# Altium schematic sheet LPDDR4_SDRAM_2.SchDoc
size A3; SheetNumber: 15; SheetTotal: 20
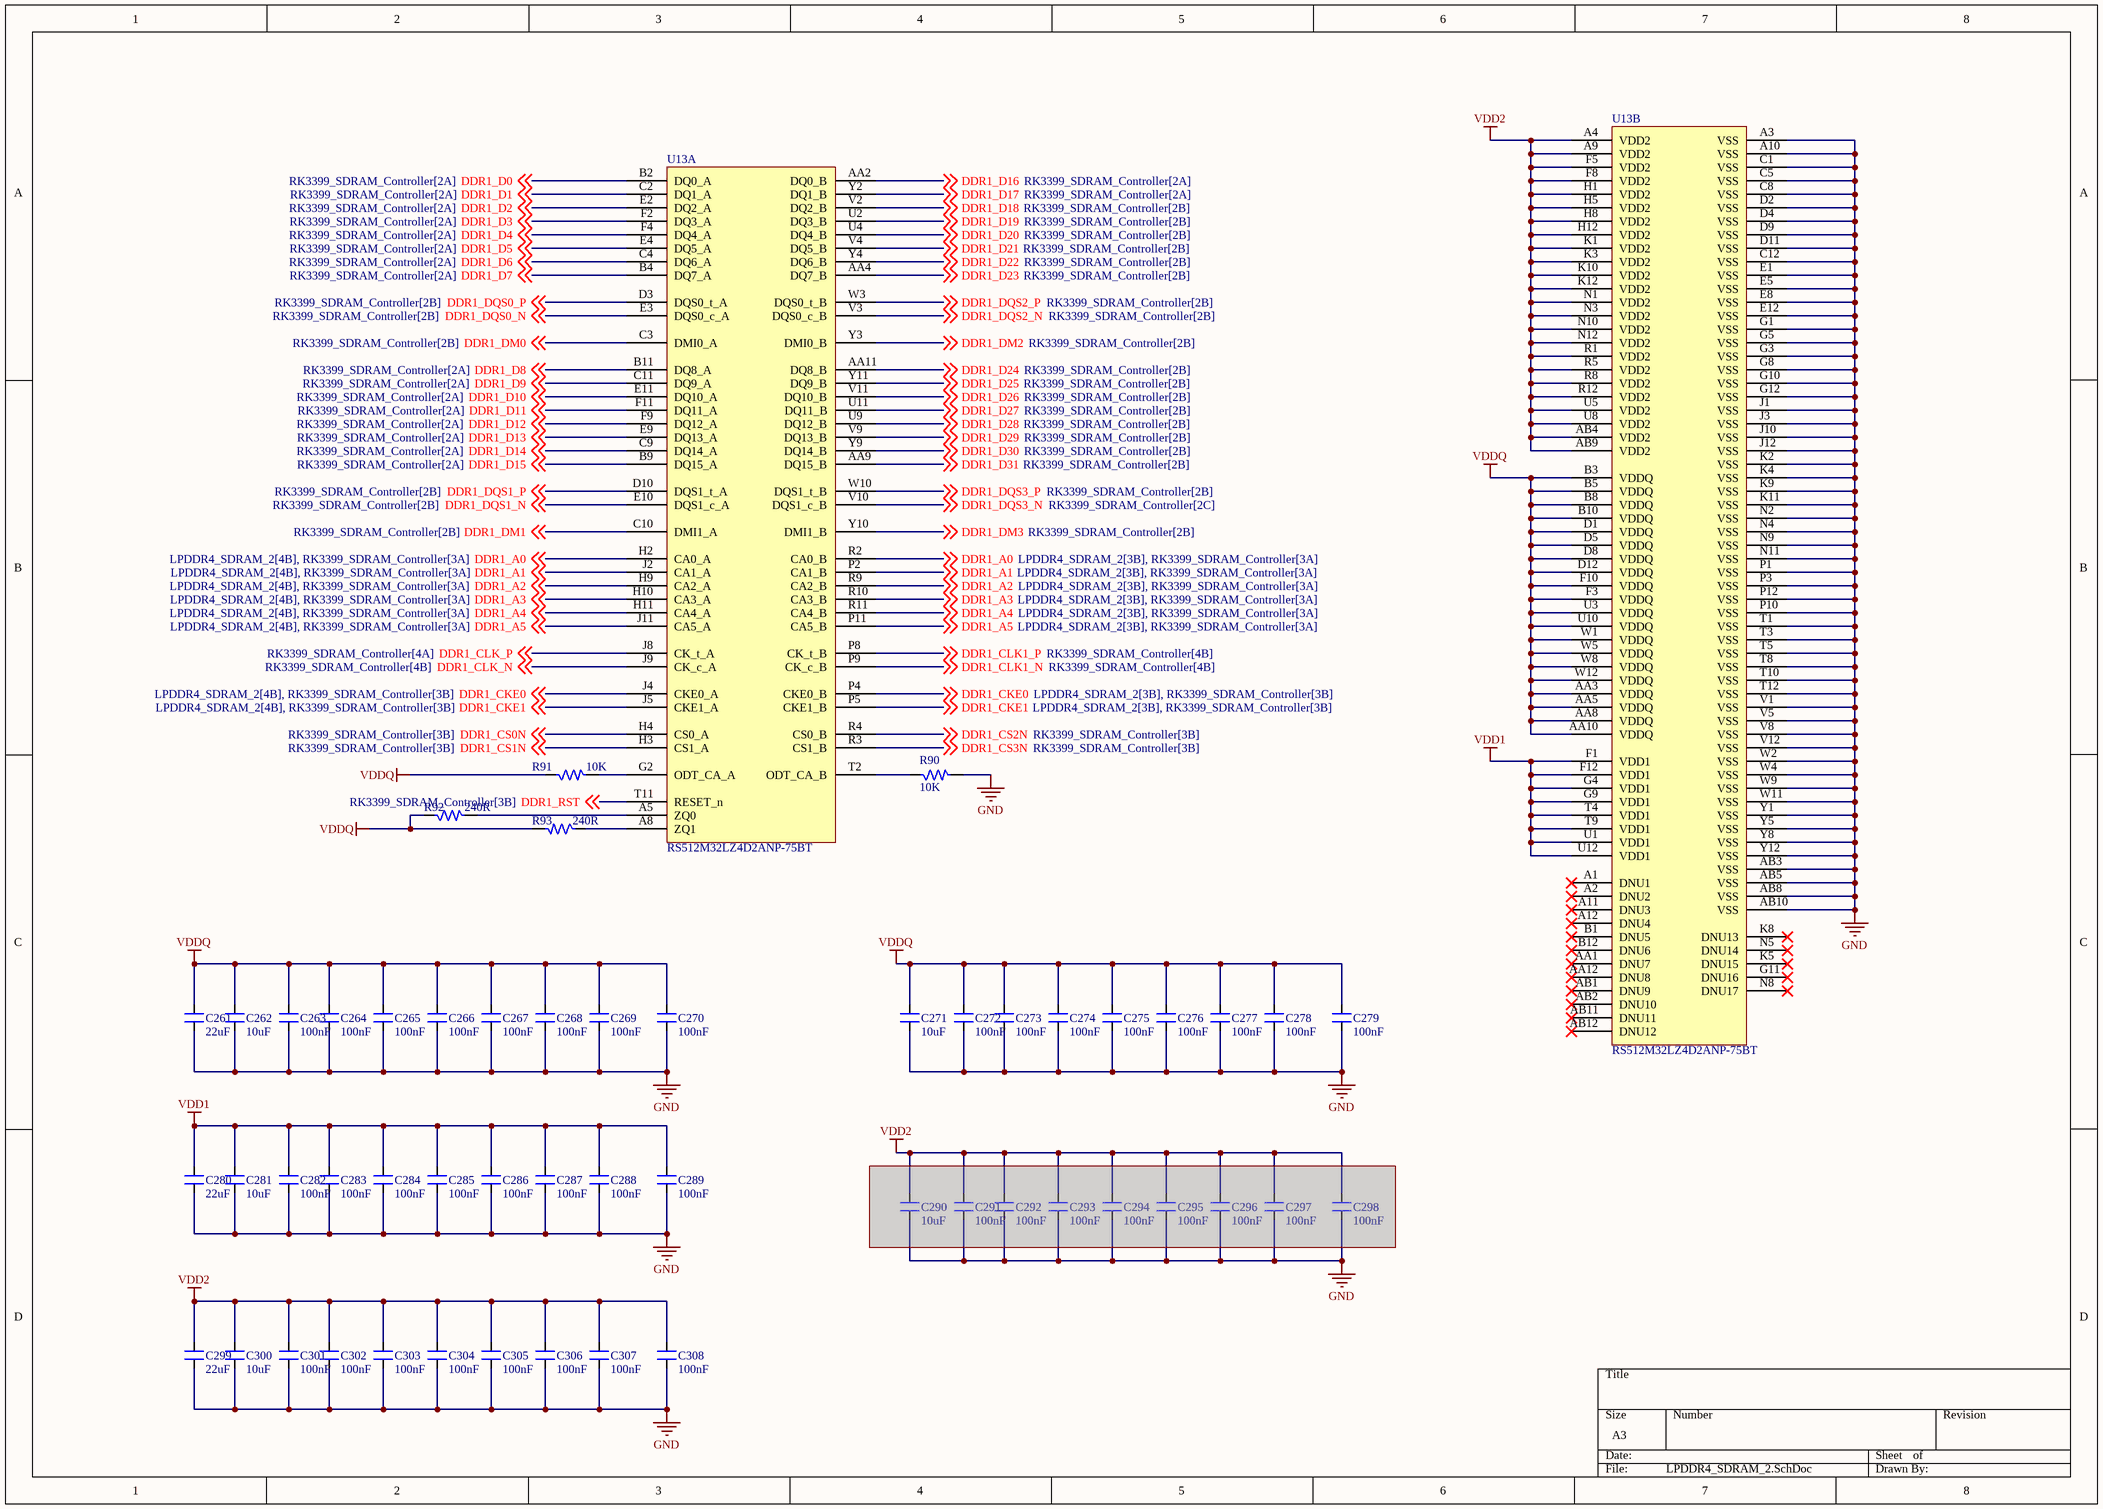
[diagram p0: LPDDR4_SDRAM_2.SchDoc]

## Parts
C261  22uF  [CAP_0603]
C262  10uF  [CAP_0603]
C263  100nF  [CAP_0201]
C264  100nF  [CAP_0201]
C265  100nF  [CAP_0201]
C266  100nF  [CAP_0201]
C267  100nF  [CAP_0201]
C268  100nF  [CAP_0201]
C269  100nF  [CAP_0201]
C270  100nF  [CAP_0201]
C271  10uF  [CAP_0603]
C272  100nF  [CAP_0201]
C273  100nF  [CAP_0201]
C274  100nF  [CAP_0201]
C275  100nF  [CAP_0201]
C276  100nF  [CAP_0201]
C277  100nF  [CAP_0201]
C278  100nF  [CAP_0201]
C279  100nF  [CAP_0201]
C280  22uF  [CAP_0603]
C281  10uF  [CAP_0603]
C282  100nF  [CAP_0201]
C283  100nF  [CAP_0201]
C284  100nF  [CAP_0201]
C285  100nF  [CAP_0201]
C286  100nF  [CAP_0201]
C287  100nF  [CAP_0201]
C288  100nF  [CAP_0201]
C289  100nF  [CAP_0201]
C290  10uF  [CAP_0603]  (masked out: inside a compile mask, not in the netlist)
C291  100nF  [CAP_0201]  (masked out: inside a compile mask, not in the netlist)
C292  100nF  [CAP_0201]  (masked out: inside a compile mask, not in the netlist)
C293  100nF  [CAP_0201]  (masked out: inside a compile mask, not in the netlist)
C294  100nF  [CAP_0201]  (masked out: inside a compile mask, not in the netlist)
C295  100nF  [CAP_0201]  (masked out: inside a compile mask, not in the netlist)
C296  100nF  [CAP_0201]  (masked out: inside a compile mask, not in the netlist)
C297  100nF  [CAP_0201]  (masked out: inside a compile mask, not in the netlist)
C298  100nF  [CAP_0201]  (masked out: inside a compile mask, not in the netlist)
C299  22uF  [CAP_0603]
C300  10uF  [CAP_0603]
C301  100nF  [CAP_0201]
C302  100nF  [CAP_0201]
C303  100nF  [CAP_0201]
C304  100nF  [CAP_0201]
C305  100nF  [CAP_0201]
C306  100nF  [CAP_0201]
C307  100nF  [CAP_0201]
C308  100nF  [CAP_0201]
R90  10K  [RES_0201]
R91  10K  [RES_0201]
R92  240R  [RES_0201]
R93  240R  [RES_0201]
U13  RS512M32LZ4D2ANP-75BT  [FBGA200_SMD]  (parts A,B of 2)

## Nets
GND: C261.1 C262.1 C263.2 C264.2 C265.2 C266.2 C267.2 C268.2 C269.2 C270.2 C271.1 C272.2 C273.2 C274.2 C275.2 C276.2 C277.2 C278.2 C279.2 C280.1 C281.1 C282.2 C283.2 C284.2 C285.2 C286.2 C287.2 C288.2 C289.2 C299.1 C300.1 C301.2 C302.2 C303.2 C304.2 C305.2 C306.2 C307.2 C308.2 R90.2 U13.A3(VSS) U13.A10(VSS) U13.AB3(VSS) U13.AB5(VSS) U13.AB8(VSS) U13.AB10(VSS) U13.C1(VSS) U13.C5(VSS) U13.C8(VSS) U13.C12(VSS) U13.D2(VSS) U13.D4(VSS) U13.D9(VSS) U13.D11(VSS) U13.E1(VSS) U13.E5(VSS) U13.E8(VSS) U13.E12(VSS) U13.G1(VSS) U13.G3(VSS) U13.G5(VSS) U13.G8(VSS) U13.G10(VSS) U13.G12(VSS) U13.J1(VSS) U13.J3(VSS) U13.J10(VSS) U13.J12(VSS) U13.K2(VSS) U13.K4(VSS) U13.K9(VSS) U13.K11(VSS) U13.N2(VSS) U13.N4(VSS) U13.N9(VSS) U13.N11(VSS) U13.P1(VSS) U13.P3(VSS) U13.P10(VSS) U13.P12(VSS) U13.T1(VSS) U13.T3(VSS) U13.T5(VSS) U13.T8(VSS) U13.T10(VSS) U13.T12(VSS) U13.V1(VSS) U13.V5(VSS) U13.V8(VSS) U13.V12(VSS) U13.W2(VSS) U13.W4(VSS) U13.W9(VSS) U13.W11(VSS) U13.Y1(VSS) U13.Y5(VSS) U13.Y8(VSS) U13.Y12(VSS)
VDD1: C280.2 C281.2 C282.1 C283.1 C284.1 C285.1 C286.1 C287.1 C288.1 C289.1 U13.F1(VDD1) U13.F12(VDD1) U13.G4(VDD1) U13.G9(VDD1) U13.T4(VDD1) U13.T9(VDD1) U13.U1(VDD1) U13.U12(VDD1)
VDD2: C299.2 C300.2 C301.1 C302.1 C303.1 C304.1 C305.1 C306.1 C307.1 C308.1 U13.A4(VDD2) U13.A9(VDD2) U13.AB4(VDD2) U13.AB9(VDD2) U13.F5(VDD2) U13.F8(VDD2) U13.H1(VDD2) U13.H5(VDD2) U13.H8(VDD2) U13.H12(VDD2) U13.K1(VDD2) U13.K3(VDD2) U13.K10(VDD2) U13.K12(VDD2) U13.N1(VDD2) U13.N3(VDD2) U13.N10(VDD2) U13.N12(VDD2) U13.R1(VDD2) U13.R5(VDD2) U13.R8(VDD2) U13.R12(VDD2) U13.U5(VDD2) U13.U8(VDD2)
VDDQ: C261.2 C262.2 C263.1 C264.1 C265.1 C266.1 C267.1 C268.1 C269.1 C270.1 C271.2 C272.1 C273.1 C274.1 C275.1 C276.1 C277.1 C278.1 C279.1 R91.1 R92.1 R93.2 U13.AA3(VDDQ) U13.AA5(VDDQ) U13.AA8(VDDQ) U13.AA10(VDDQ) U13.B3(VDDQ) U13.B5(VDDQ) U13.B8(VDDQ) U13.B10(VDDQ) U13.D1(VDDQ) U13.D5(VDDQ) U13.D8(VDDQ) U13.D12(VDDQ) U13.F3(VDDQ) U13.F10(VDDQ) U13.U3(VDDQ) U13.U10(VDDQ) U13.W1(VDDQ) U13.W5(VDDQ) U13.W8(VDDQ) U13.W12(VDDQ)
DDR1_A0: U13.H2(CA0_A) U13.R2(CA0_B) ; off-sheet DDR1_A0
DDR1_A1: U13.J2(CA1_A) U13.P2(CA1_B) ; off-sheet DDR1_A1
DDR1_A2: U13.H9(CA2_A) U13.R9(CA2_B) ; off-sheet DDR1_A2
DDR1_A3: U13.H10(CA3_A) U13.R10(CA3_B) ; off-sheet DDR1_A3
DDR1_A4: U13.H11(CA4_A) U13.R11(CA4_B) ; off-sheet DDR1_A4
DDR1_A5: U13.J11(CA5_A) U13.P11(CA5_B) ; off-sheet DDR1_A5
DDR1_CKE0: U13.J4(CKE0_A) U13.P4(CKE0_B) ; off-sheet DDR1_CKE0
DDR1_CKE1: U13.J5(CKE1_A) U13.P5(CKE1_B) ; off-sheet DDR1_CKE1
DDR1_CLK1_N: U13.P9(CK_c_B) ; off-sheet DDR1_CLK1_N
DDR1_CLK1_P: U13.P8(CK_t_B) ; off-sheet DDR1_CLK1_P
DDR1_CLK_N: U13.J9(CK_c_A) ; off-sheet DDR1_CLK_N
DDR1_CLK_P: U13.J8(CK_t_A) ; off-sheet DDR1_CLK_P
DDR1_CS0N: U13.H4(CS0_A) ; off-sheet DDR1_CS0N
DDR1_CS1N: U13.H3(CS1_A) ; off-sheet DDR1_CS1N
DDR1_CS2N: U13.R4(CS0_B) ; off-sheet DDR1_CS2N
DDR1_CS3N: U13.R3(CS1_B) ; off-sheet DDR1_CS3N
DDR1_D0: U13.B2(DQ0_A) ; off-sheet DDR1_D0
DDR1_D1: U13.C2(DQ1_A) ; off-sheet DDR1_D1
DDR1_D2: U13.E2(DQ2_A) ; off-sheet DDR1_D2
DDR1_D3: U13.F2(DQ3_A) ; off-sheet DDR1_D3
DDR1_D4: U13.F4(DQ4_A) ; off-sheet DDR1_D4
DDR1_D5: U13.E4(DQ5_A) ; off-sheet DDR1_D5
DDR1_D6: U13.C4(DQ6_A) ; off-sheet DDR1_D6
DDR1_D7: U13.B4(DQ7_A) ; off-sheet DDR1_D7
DDR1_D8: U13.B11(DQ8_A) ; off-sheet DDR1_D8
DDR1_D9: U13.C11(DQ9_A) ; off-sheet DDR1_D9
DDR1_D10: U13.E11(DQ10_A) ; off-sheet DDR1_D10
DDR1_D11: U13.F11(DQ11_A) ; off-sheet DDR1_D11
DDR1_D12: U13.F9(DQ12_A) ; off-sheet DDR1_D12
DDR1_D13: U13.E9(DQ13_A) ; off-sheet DDR1_D13
DDR1_D14: U13.C9(DQ14_A) ; off-sheet DDR1_D14
DDR1_D15: U13.B9(DQ15_A) ; off-sheet DDR1_D15
DDR1_D16: U13.AA2(DQ0_B) ; off-sheet DDR1_D16
DDR1_D17: U13.Y2(DQ1_B) ; off-sheet DDR1_D17
DDR1_D18: U13.V2(DQ2_B) ; off-sheet DDR1_D18
DDR1_D19: U13.U2(DQ3_B) ; off-sheet DDR1_D19
DDR1_D20: U13.U4(DQ4_B) ; off-sheet DDR1_D20
DDR1_D21: U13.V4(DQ5_B) ; off-sheet DDR1_D21
DDR1_D22: U13.Y4(DQ6_B) ; off-sheet DDR1_D22
DDR1_D23: U13.AA4(DQ7_B) ; off-sheet DDR1_D23
DDR1_D24: U13.AA11(DQ8_B) ; off-sheet DDR1_D24
DDR1_D25: U13.Y11(DQ9_B) ; off-sheet DDR1_D25
DDR1_D26: U13.V11(DQ10_B) ; off-sheet DDR1_D26
DDR1_D27: U13.U11(DQ11_B) ; off-sheet DDR1_D27
DDR1_D28: U13.U9(DQ12_B) ; off-sheet DDR1_D28
DDR1_D29: U13.V9(DQ13_B) ; off-sheet DDR1_D29
DDR1_D30: U13.Y9(DQ14_B) ; off-sheet DDR1_D30
DDR1_D31: U13.AA9(DQ15_B) ; off-sheet DDR1_D31
DDR1_DM0: U13.C3(DMI0_A) ; off-sheet DDR1_DM0
DDR1_DM1: U13.C10(DMI1_A) ; off-sheet DDR1_DM1
DDR1_DM2: U13.Y3(DMI0_B) ; off-sheet DDR1_DM2
DDR1_DM3: U13.Y10(DMI1_B) ; off-sheet DDR1_DM3
DDR1_DQS0_N: U13.E3(DQS0_c_A) ; off-sheet DDR1_DQS0_N
DDR1_DQS0_P: U13.D3(DQS0_t_A) ; off-sheet DDR1_DQS0_P
DDR1_DQS1_N: U13.E10(DQS1_c_A) ; off-sheet DDR1_DQS1_N
DDR1_DQS1_P: U13.D10(DQS1_t_A) ; off-sheet DDR1_DQS1_P
DDR1_DQS2_N: U13.V3(DQS0_c_B) ; off-sheet DDR1_DQS2_N
DDR1_DQS2_P: U13.W3(DQS0_t_B) ; off-sheet DDR1_DQS2_P
DDR1_DQS3_N: U13.V10(DQS1_c_B) ; off-sheet DDR1_DQS3_N
DDR1_DQS3_P: U13.W10(DQS1_t_B) ; off-sheet DDR1_DQS3_P
DDR1_RST: U13.T11(RESET_n) ; off-sheet DDR1_RST
NetR90_1: R90.1 U13.T2(ODT_CA_B)
NetR91_2: R91.2 U13.G2(ODT_CA_A)
NetR92_2: R92.2 U13.A5(ZQ0)
NetR93_1: R93.1 U13.A8(ZQ1)

Not connected (* = marked no-connect by the designer): U13 A1(DNU1)* A2(DNU2)* A11(DNU3)* A12(DNU4)* AA1(DNU7)* AA12(DNU8)* AB1(DNU9)* AB2(DNU10)* AB11(DNU11)* AB12(DNU12)* B1(DNU5)* B12(DNU6)* G11(DNU16)* K5(DNU15)* K8(DNU13)* N5(DNU14)* N8(DNU17)*

## Library data of the parts
C261 C280 C299 = CAP_22uF-10V-20%-0603: 22µF ±20% 10V Ceramic Capacitor X5R 0603 (1608 Metric); Manufacturer: Murata Electronics; Manufacturer Part Number: GRM188R61A226ME15D; Case/Package: 0603; Supplier-1: Digikey
C262 C271 C281 C290 C300 = CAP_10uF-10V-10%-0603: 10µF ±10% 10V Ceramic Capacitor X5R 0603 (1608 Metric); Manufacturer Part Number: GRM188R61A106KE69J; Manufacturer: Murata Electronics; Case/Package: 0603; Supplier-1: Digikey
C263-C270 C272-C279 C282-C289 C291-C298 C301-C308 = CAP_100nF-25V-10%-0201: 0.1µF ±10% 25V Ceramic Capacitor X5R 0201 (0603 Metric); Manufacturer: TDK Corporation; Manufacturer Part Number: C0603X5R1E104K030BB; Case/Package: 0201; Supplier-1: Digikey
R90 R91 = RES_10K-0.05W-1%-0201: 10 kOhms ±1% 0.05W, 1/20W Chip Resistor 0201 (0603 Metric) Thick Film; Manufacturer: Stackpole Electronics Inc; Manufacturer Part Number: RMCF0201FT10K0; Case/Package: 0201; Supplier-1: Digikey
R92 R93 = RES_240R-0.05W-1%-0201: 240 Ohms ±1% 0.05W, 1/20W Chip Resistor 0201 (0603 Metric) Thick Film; Manufacturer: Yageo; Manufacturer Part Number: RC0201FR-07240RL; Case/Package: 0201; Supplier-1: Digikey
U13 = IC_RS512M32LZ4D2ANP-75BT: LPDDR4/4X Package FBGA 200b Density 4Gbit~64Gbit Operating Temperature Range：-25~85℃ Speed：2667Mbps/3200Mbps/3733Mbps Voltage：VDD1/VDD2/VDDQ= 1.8 / 1.1 / 1.1 V（LPDDR4）VDD1/VDD2/VDDQ = 1.8 / 1.1 / 0.6 V（LPDDR4X）Approved Verification Platform：MTK、Spreadtrum; Manufacturer: RAYSON; Manufacturer Part Number: RS512M32LZ4D2ANP-75BT; Case/Package: FBGA 200b; Supplier-1: RAYSON